# EAGLE schematic esp32 with mpu6050 (EAGLE 9.6.2)
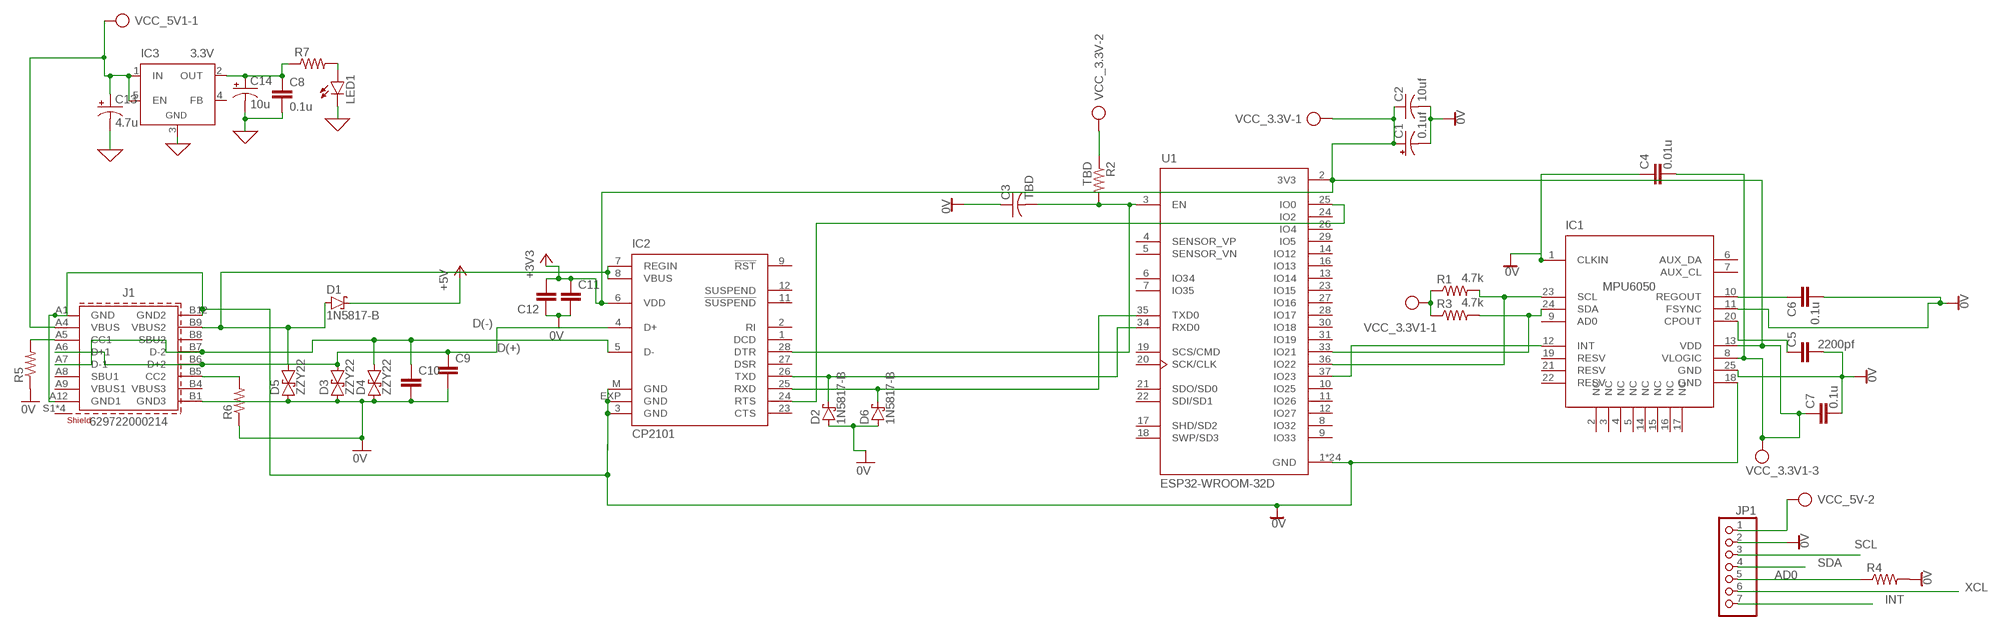
[diagram p0: schematic, sheet 1]

## Parts
C1  0.1uf  CPOL-USE3.5-10  [E3,5-10]
C2  10uf  C-USC0805  [C0805]
C3  TBD  C-USC0805  [C0805]
C4  0.01u  C-EU025-024X044  [C025-024X044]
C5  2200pf  C-EU025-024X044  [C025-024X044]
C6  0.1u  C-EU025-024X044  [C025-024X044]
C7  0.1u  C-EU025-024X044  [C025-024X044]
C8  0.1u  C-EUHPC0201  [HPC0201]
C9  C-EUHPC0201  [HPC0201]
C10  C-EUHPC0201  [HPC0201]
C11  C-EUHPC0201  [HPC0201]
C12  C-EUHPC0201  [HPC0201]
C13  4.7u  CPOL-USE2.5-7  [E2,5-7]
C14  10u  CPOL-USE2.5-7  [E2,5-7]
D1  1N5817-B  [DO41-7.6]
D2  1N5817-B  [DO41-7.6]
D3  ZZY22  [P3-15]
D4  ZZY22  [P3-15]
D5  ZZY22  [P3-15]
D6  1N5817-B  [DO41-7.6]
IC1  MPU6050  [QFN50P400X400X95-25T265X275N]
IC2  CP2101  [MLP28]
IC3  3.3V  LM2596TH  [TO220-52]
J1  629722000214  [629722000214]
JP1  PINHD-1X7/90  [1X07/90]
LED1  LED3MM  [LED3MM]
R1  4.7k  R-US_0207/5V  [0207/5V]
R2  TBD  R-US_0207/5V  [0207/5V]
R3  4.7k  R-US_0207/5V  [0207/5V]
R4  R-US_0207/5V  [0207/5V]
R5  R-US_0207/5V  [0207/5V]
R6  R-US_0207/5V  [0207/5V]
R7  R-US_0207/5V  [0207/5V]
U1  ESP32-WROOM-32D  [MODULE_ESP32-WROOM-32D]
VCC_3.3V  AK300/2  [AK300/2]
VCC_3.3V1  AK300/3  [AK300/3]
VCC_5V  AK300/2  [AK300/2]
VCC_5V1  AK300/2  [AK300/2]

## Nets
0: C8.2 C13.- C14.- IC3.3(GND) LED1.K(C) ; supply symbol labelled GND
0V: C1.- C2.2 C3.1 C4.1 C5.2 C6.2 C7.2 C9.2 C10.2 C11.2 C12.1 D2.A D3.A D4.A D5.A D6.A IC1.1(CLKIN) IC1.11(FSYNC) IC1.18(GND) IC1.25(GND) J1.A1(GND) J1.A12(GND1) J1.B1(GND3) J1.B12(GND2) JP1.2 R4.2 R5.1 R6.1 U1.1(GND) U1.15(GND) U1.38(GND) U1.39_1(GND) U1.39_2(GND) U1.39_3(GND) U1.39_4(GND) U1.39_5(GND) U1.39_6(GND) U1.39_7(GND) U1.39_8(GND) U1.39_9(GND) U1.39_10(GND) U1.39_11(GND) U1.39_12(GND) U1.39_13(GND) U1.39_14(GND) U1.39_15(GND) U1.39_16(GND) U1.39_17(GND) U1.39_18(GND) U1.39_19(GND) U1.39_20(GND) U1.39_21(GND)
+3V3: C1.+ C2.1 C4.2 C7.1 C11.1 C12.2 IC1.8(VLOGIC) IC1.13(VDD) IC2.6(VDD) U1.2(3V3) VCC_3.3V1.3 VCC_3.3V.1
+5V: D1.C
AD0: JP1.5 R4.1
D(+): C9.1 D3.C IC2.4(D+) J1.A6(D+1) J1.B6(D+2)
D(-): C10.1 D4.C IC2.5(D-) J1.A7(D-1) J1.B7(D-2)
INT: JP1.7
N$1: IC1.24(SDA) R3.2 U1.33(IO21)
N$2: C3.2 IC2.28(DTR) R2.2 U1.3(EN)
N$3: C5.1 IC1.20(CPOUT)
N$4: LED1.A R7.2
N$5: C6.1 IC1.10(REGOUT)
N$6: IC1.23(SCL) R1.2 U1.36(IO22)
N$8: IC1.12(INT) U1.37(IO23)
N$9: IC2.24(RTS) U1.25(IO0)
N$10: R2.1 VCC_3.3V.2
N$12: J1.B5(CC2) R6.2
N$13: J1.A5(CC1) R5.2
N$14: JP1.1 VCC_5V.2
N$15: R1.1 R3.1 VCC_3.3V1.1
N$16: D1.A D5.C IC2.7(REGIN) IC2.8(VBUS) J1.B9(VBUS2)
N$17: D2.C IC2.26(TXD) U1.34(RXD0)
N$18: D6.C IC2.25(RXD) U1.35(TXD0)
N$19: IC2.3(GND) IC2.EXP(GND) IC2.M(GND)
N$20: C8.1 C14.+ IC3.2(OUT) R7.1
N$22: C13.+ IC3.1(IN) IC3.5(EN) J1.A4(VBUS) VCC_5V1.1
SCL: JP1.3
SDA: JP1.4
XCL: JP1.6
Unconnected: IC1.2(NC) IC1.3(NC) IC1.4(NC) IC1.5(NC) IC1.6(AUX_DA) IC1.7(AUX_CL) IC1.9(AD0) IC1.14(NC) IC1.15(NC) IC1.16(NC) IC1.17(NC) IC1.19(RESV) IC1.21(RESV) IC1.22(RESV) IC2.1(DCD) IC2.2(RI) IC2.9(!RST) IC2.11(!SUSPEND) IC2.12(SUSPEND) IC2.23(CTS) IC2.27(DSR) IC3.4(FB) J1.A8(SBU1) J1.A9(VBUS1) J1.B4(VBUS3) J1.B8(SBU2) J1.S1(SHIELD) J1.S2(SHIELD) J1.S3(SHIELD) J1.S4(SHIELD) U1.4(SENSOR_VP) U1.5(SENSOR_VN) U1.6(IO34) U1.7(IO35) U1.8(IO32) U1.9(IO33) U1.10(IO25) U1.11(IO26) U1.12(IO27) U1.13(IO14) U1.14(IO12) U1.16(IO13) U1.17(SHD/SD2) U1.18(SWP/SD3) U1.19(SCS/CMD) U1.20(SCK/CLK) U1.21(SDO/SD0) U1.22(SDI/SD1) U1.23(IO15) U1.24(IO2) U1.26(IO4) U1.27(IO16) U1.28(IO17) U1.29(IO5) U1.30(IO18) U1.31(IO19) VCC_3.3V1.2 VCC_5V1.2 VCC_5V.1

## Library data of the parts
C1 C13 C14 = rcl:CPOL-US: POLARIZED CAPACITOR, American symbol; SPICEPREFIX: C
C2 C3 = rcl:C-US: CAPACITOR, American symbol; SPICEPREFIX: C
C4-C12 = rcl:C-EU: CAPACITOR, European symbol; SPICEPREFIX: C
D1 D2 D6 = diode:1N581*: 1.0A SCHOTTKY BARRIER RECTIFIER Source: http://www.diodes.com/datasheets/ds23001.pdf
D3-D5 = diode:ZZY22: DIODE
IC1 = invensense:MPU6050: The triple-axis MEMS gyroscope
IC2 = silabs:CP210*: Single-Chip USB to UART Bridge Source: www.silabs.com .. CP2101.pdf / cp2102.pdf; MF: FARNELL; MPN: CP2102-GM; OC_FARNELL: 9282130; OC_NEWARK: 30K5635
IC3 = linear:LM2596T: STEP-DOWN VOLTAGE REGULATOR
J1 = Eagle_WR-USB (rev22c):629722000214: WR-COM USB 2.0 Type C Plug Vertical SMT Kind Properties Durability 10 000 Mating cycles Gender Receptacle Type Horizontal General Information Operating Temperature -40 up to +85 °C Electrical Properties Working Voltage 20 V (DC) Withstanding Voltage 100 V (AC) Contact Resistance 40 mΩ Material Properties Insulator Material LCP Insulator Flammability Rating UL94 V-0 Insulator Color Black Contact Material Brass Contact Plating Gold over Nickel Contact Type Stamped Shielding Material Steel Shielding Plating Nickel (Ni) <https://www.we-online.com/catalog/media/o689297v209%20family-wr-com-629722000214.jpg> Details see: www.we-online.com/catalog/WR-COM_USB_20_TYPE_C_RECEPTACLE_HORIZONTAL_SMT <www.we-online.com/catalog/WR-COM_USB_20_TYPE_C_RECEPTACLE_HORIZONTAL_SMT/?utm_source=eagle_model&utm_medium=description_link&utm_campaign=eisos_eagle> Updated by Ella Wu 2022-11-15 2022 (C) Würth Elektronik; APPLICATION: USB 2.0; DATASHEET-URL: https://www.we-online.com/redexpert/spec/629722000214?ae; GERDER: Receptacle; INTERFACE-TYPE: Type C; IR: 5A; MOUNT: SMT; PACKAGING: Tape and Reel; PART-NUMBER: 629722000214; PINS: 16; TYPE: Horizontal; WORKING-VOLTAGE: 20V(AC)
JP1 = pinhead:PINHD-1X7: PIN HEADER
LED1 = led:LED: LED OSRAM: - CHIPLED LG R971, LG N971, LY N971, LG Q971, LY Q971, LO R971, LY R971 LH N974, LH R974 LS Q976, LO Q976, LY Q976 LO Q996 - Hyper CHIPLED LW Q18S LB Q993, LB Q99A, LB R99A - SideLED LS A670, LO A670, LY A670, LG A670, LP A670 LB A673, LV A673, LT A673, LW A673 LH A674 LY A675 LS A676, LA A676, LO A676, LY A676, LW A676 LS A679, LY A679, LG A679 - Hyper Micro SIDELED® LS Y876, LA Y876, LO Y876, LY Y876 LT Y87S - SmartLED LW L88C, LW L88S LB L89C, LB L89S, LG L890 LS L89K, LO L89K, LY L89K LS L896, LA L896, LO L896, LY L896 - TOPLED LS T670, LO T670, LY T670, LG T670, LP T670 LSG T670, LSP T670, LSY T670, LOP T670, LYG T670 LG T671, LOG T671, LSG T671 LB T673, LV T673, LT T673, LW T673 LH T674 LS T676, LA T676, LO T676, LY T676, LB T676, LH T676, LSB T676, LW T676 LB T67C, LV T67C, LT T67C, LS T67K, LO T67K, LY T67K, LW E67C LS E67B, LA E67B, LO E67B, LY E67B, LB E67C, LV E67C, LT E67C LW T67C LS T679, LY T679, LG T679 LS T770, LO T770, LY T770, LG T770, LP T770 LB T773, LV T773, LT T773, LW T773 LH T774 LS E675, LA E675, LY E675, LS T675 LS T776, LA T776, LO T776, LY T776, LB T776 LHGB T686 LT T68C, LB T68C - Hyper Mini TOPLED® LB M676 - Mini TOPLED Santana® LG M470 LS M47K, LO M47K, LY M47K Source: http://www.osram.convergy.de LUXEON: - LUMILED® LXK2-PW12-R00, LXK2-PW12-S00, LXK2-PW14-U00, LXK2-PW14-V00 LXK2-PM12-R00, LXK2-PM12-S00, LXK2-PM14-U00 LXK2-PE12-Q00, LXK2-PE12-R00, LXK2-PE12-S00, LXK2-PE14-T00, LXK2-PE14-U00 LXK2-PB12-K00, LXK2-PB12-L00, LXK2-PB12-M00, LXK2-PB14-N00, LXK2-PB14-P00, LXK2-PB14-Q00 LXK2-PR12-L00, LXK2-PR12-M00, LXK2-PR14-Q00, LXK2-PR14-R00 LXK2-PD12-Q00, LXK2-PD12-R00, LXK2-PD12-S00 LXK2-PH12-R00, LXK2-PH12-S00 LXK2-PL12-P00, LXK2-PL12-Q00, LXK2-PL12-R00 Source: www.luxeon.com KINGBRIGHT: KA-3528ASYC Source: www.kingbright.com
R1-R7 = rcl:R-US_: RESISTOR, American symbol; SPICEPREFIX: R
U1 = ESP32-WROOM-32D:ESP32-WROOM-32D: Bluetooth, WiFi 802.11b/g/n, Bluetooth v4.2 + EDR, Class 1, 2 and 3 Transceiver Module 2.4GHz ~ 2.5GHz Integrated, Trace Surface Mount Check availability <https://pricing.snapeda.com/parts/ESP32-WROOM-32D/Espressif%20Systems/view-part?ref=eda>; AVAILABILITY: In Stock; CHECK_PRICES: https://www.snapeda.com/parts/ESP32-WROOM-32D/Espressif+Systems/view-part/?ref=eda; DESCRIPTION: Bluetooth, WiFi 802.11b/g/n, Bluetooth v4.2 +EDR, Class 1, 2 and 3 Transceiver Module 2.4GHz ~ 2.5GHz Integrated; MF: Espressif Systems; MP: ESP32-WROOM-32D; PACKAGE: Non Standard Espressif Systems; PRICE: None; SNAPEDA_LINK: https://www.snapeda.com/parts/ESP32-WROOM-32D/Espressif+Systems/view-part/?ref=snap
VCC_3.3V VCC_5V VCC_5V1 = con-ptr500:AK300/2: CONNECTOR; OC_FARNELL: unknown; OC_NEWARK: unknown
VCC_3.3V1 = con-ptr500:AK300/3: CONNECTOR; OC_FARNELL: unknown; OC_NEWARK: unknown